# Altium project Social_Security_PRJ.PrjPcb
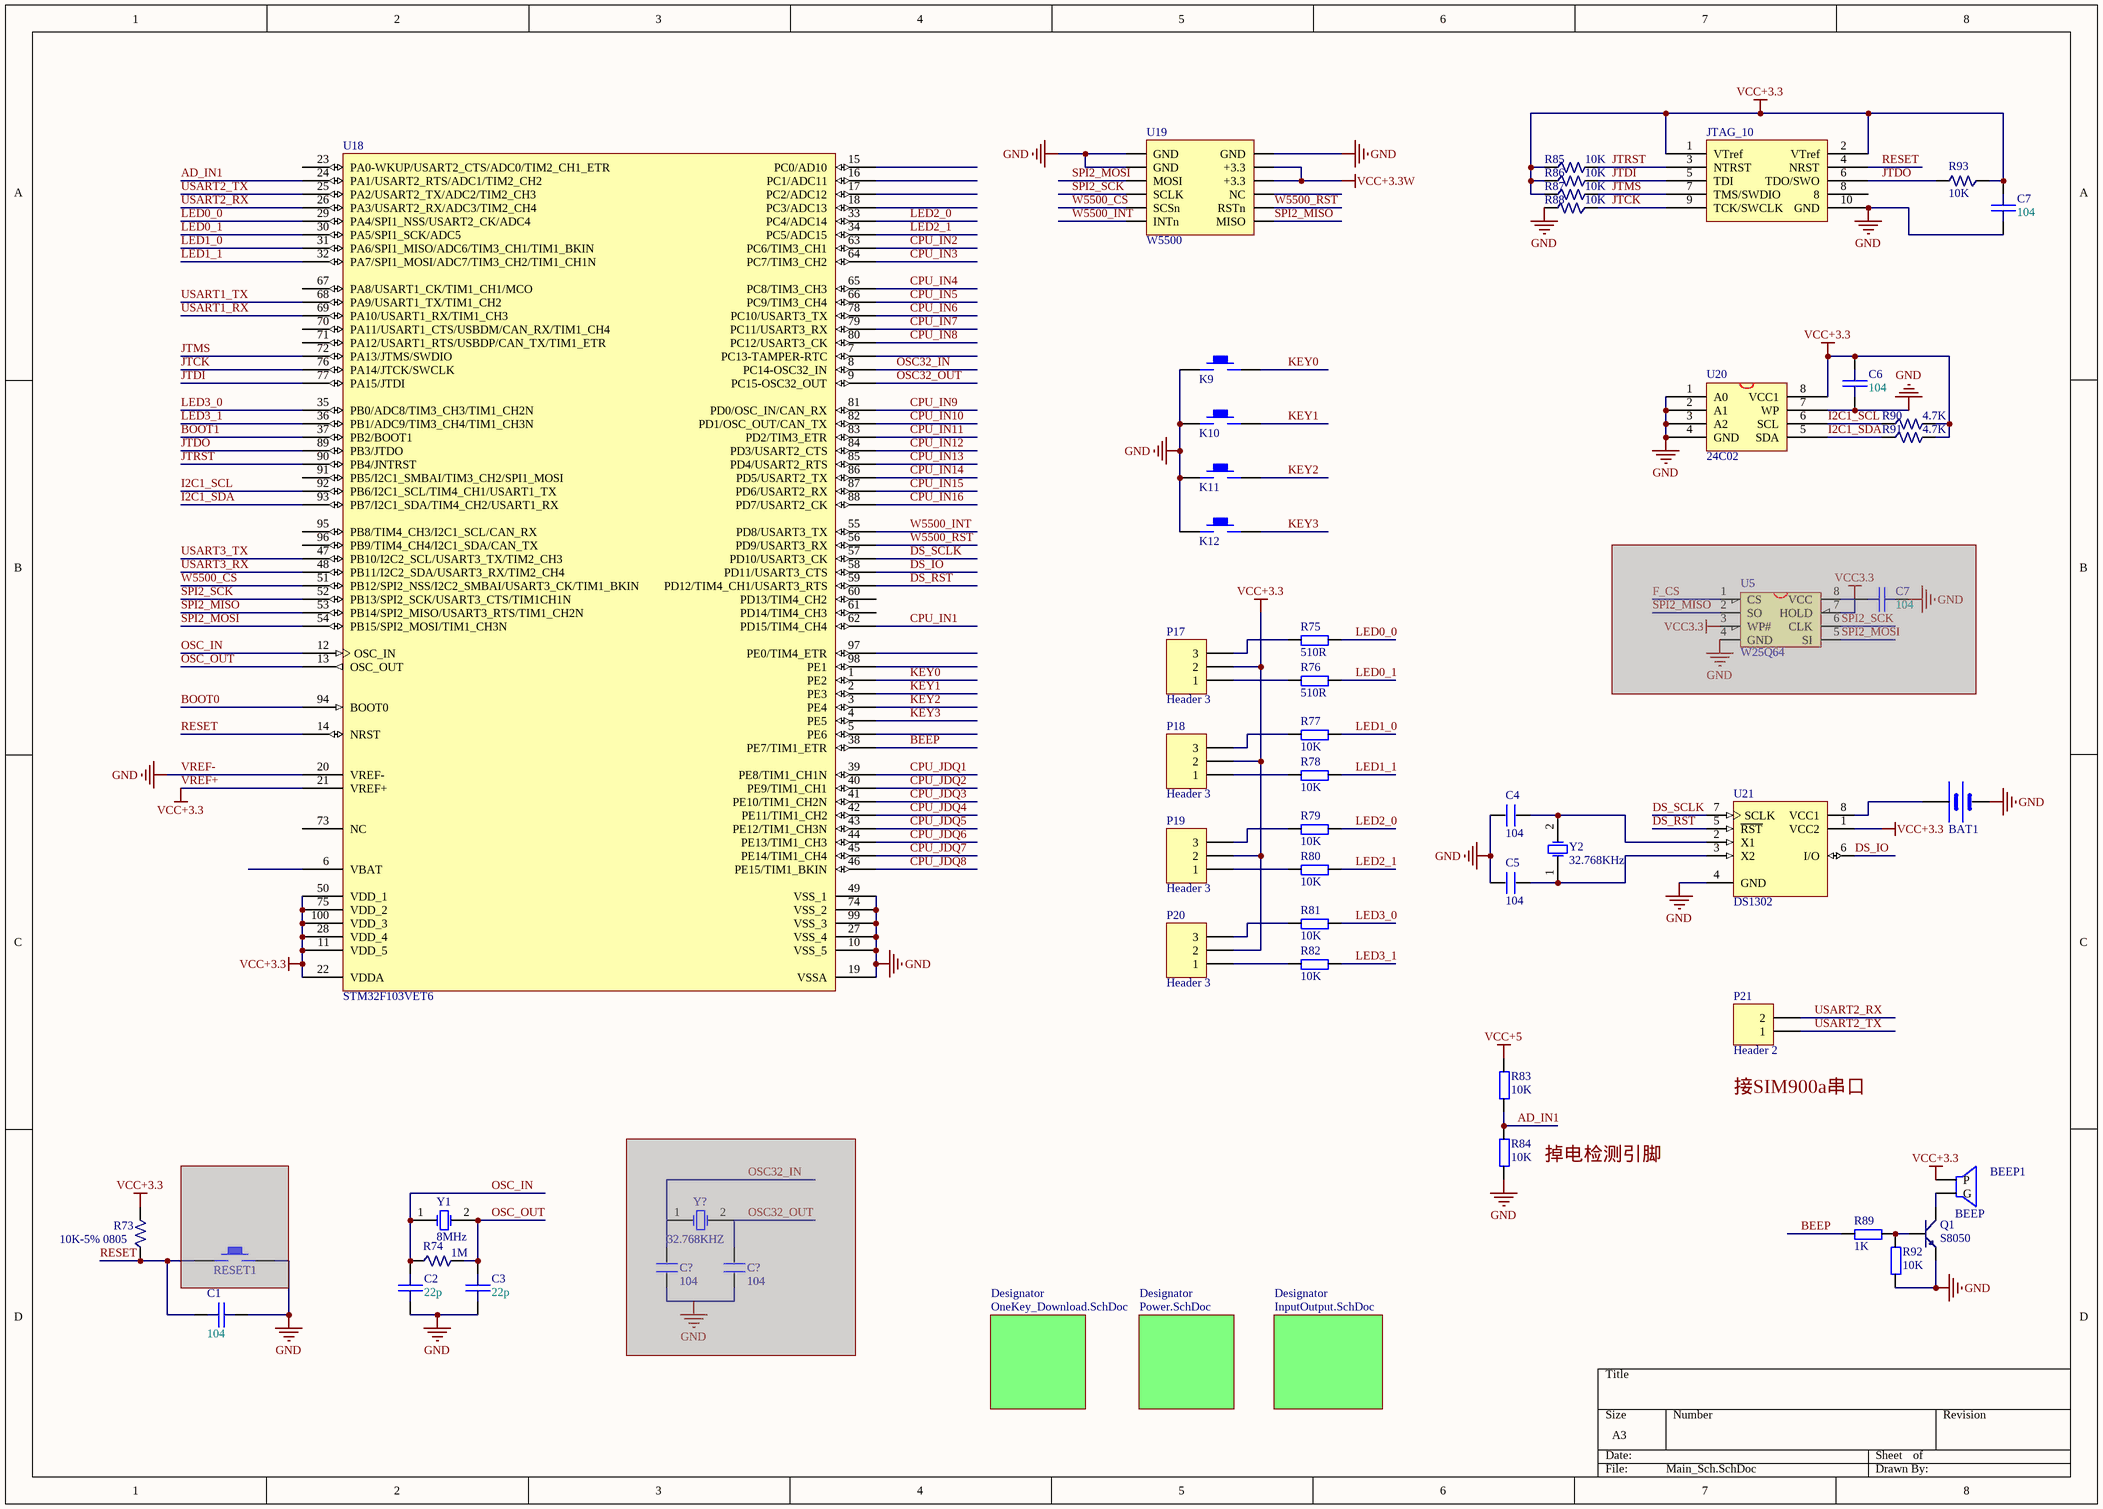
[diagram p0: Main_Sch.SchDoc]
4 sheets, 258 parts. Net scope: global (net labels, ports and power ports of the same name join across sheets).
Board file: Main_PCB.PcbDoc
Sheets:
  Main_Sch.SchDoc
    Designator = OneKey_Download.SchDoc
    Designator = Power.SchDoc
    Designator = InputOutput.SchDoc

## Sheet Main_Sch.SchDoc
size A3

### Parts
(Parts that share a designator on the sheet are numbered #1, #2 ... from top to bottom, then left to right.)
BAT1  BATT  [CR2032]  (value not drawn)
BEEP1  BEEP  [BELL-5]
C1  104  [0805-CAP]
C2  22p  [0805-CAP]
C3  22p  [0805-CAP]
C4  104  [0805-CAP]
C5  104  [0805-CAP]
C6  104  [0805-CAP]
C7#1  104  [0805-CAP]
C7#2  104  [0805-CAP]  (masked out: inside a compile mask, not in the netlist)
C?#1  104  [0805-CAP]  (masked out: inside a compile mask, not in the netlist)
C?#2  104  [0805-CAP]  (masked out: inside a compile mask, not in the netlist)
JTAG_1  JTAG_10  [JTAG_10]
K9  KEY_M  [KEY_M]  (value not drawn)
K10  KEY_M  [KEY_M]  (value not drawn)
K11  KEY_M  [KEY_M]  (value not drawn)
K12  KEY_M  [KEY_M]  (value not drawn)
P17  Header 3  [HDR1X3]
P18  Header 3  [HDR1X3]
P19  Header 3  [HDR1X3]
P20  Header 3  [HDR1X3]
P21  Header 2  [HDR1X2]
Q1  S8050  [SOT-23R]
R73  10K-5% 0805  [0805-RES]
R74  1M  [0805-RES]
R75  510R  [0805-RES]
R76  510R  [0805-RES]
R77  10K  [0805-RES]
R78  10K  [0805-RES]
R79  10K  [0805-RES]
R80  10K  [0805-RES]
R81  10K  [0805-RES]
R82  10K  [0805-RES]
R83  10K  [0805-RES]
R84  10K  [0805-RES]
R85  10K  [0805-RES]
R86  10K  [0805-RES]
R87  10K  [0805-RES]
R88  10K  [0805-RES]
R89  1K  [0805-RES]
R90  4.7K  [0805-RES]
R91  4.7K  [0805-RES]
R92  10K  [0805-RES]
R93  10K  [0805-RES]
RESET1  KEY_M  [KEY_M]  (value not drawn)  (masked out: inside a compile mask, not in the netlist)
U5#1  W25Q64  [SOIC-8]  (masked out: inside a compile mask, not in the netlist)
U18  STM32F103VET6  [LQFP100_N]
U19  W5500  [W5500-Model]
U20  24C02  [SOP-8]
U21  DS1302  [SOP-8]
Y1  8MHz  [XTAL_US]
Y2  32.768KHz  [XTAL32_1]
Y?  32.768KHZ  [XTAL32_1]  (masked out: inside a compile mask, not in the netlist)

### Sub-sheets
Designator = OneKey_Download.SchDoc: no entries
Designator = Power.SchDoc: no entries
Designator = InputOutput.SchDoc: no entries

### Nets
VCC+3.3W: U19.10(+3.3) U19.11(+3.3)
VCC+5: R83.2
VREF+: BEEP1.1(P) C6.1 C7#1.1 JTAG_1.1(VTref) JTAG_1.2(VTref) P17.2 P18.2 P19.2 P20.2 R73.2 R85.1 R86.1 R87.1 R90.2 R91.2 R93.1 U18.11(VDD_5) U18.21(VREF+) U18.22(VDDA) U18.28(VDD_4) U18.50(VDD_1) U18.75(VDD_2) U18.100(VDD_3) U20.8(VCC1) U21.1(VCC2)  [also labelled VCC+3.3]
VREF-: BAT1.2(GND) C1.2 C2.2 C3.2 C4.1 C5.1 C6.2 C7#1.2 JTAG_1.10(GND) K9.1 K10.1 K11.1 K12.1 Q1.1(E) R84.1 R88.2 R92.1 U18.10(VSS_5) U18.19(VSSA) U18.20(VREF-) U18.27(VSS_4) U18.49(VSS_1) U18.74(VSS_2) U18.99(VSS_3) U19.1(GND) U19.2(GND) U19.12(GND) U20.1(A0) U20.2(A1) U20.3(A2) U20.4(GND) U20.7(WP) U21.4(GND)  [also labelled GND]
AD_IN1: R83.1 R84.2 U18.24(PA1/USART2_RTS/ADC1/TIM2_CH2)
BEEP: R89.1 U18.38(PE7/TIM1_ETR)
BOOT0: U18.94(BOOT0)
BOOT1: U18.37(PB2/BOOT1)
CPU_IN1: U18.62(PD15/TIM4_CH4)
CPU_IN2: U18.63(PC6/TIM3_CH1)
CPU_IN3: U18.64(PC7/TIM3_CH2)
CPU_IN4: U18.65(PC8/TIM3_CH3)
CPU_IN5: U18.66(PC9/TIM3_CH4)
CPU_IN6: U18.78(PC10/USART3_TX)
CPU_IN7: U18.79(PC11/USART3_RX)
CPU_IN8: U18.80(PC12/USART3_CK)
CPU_IN9: U18.81(PD0/OSC_IN/CAN_RX)
CPU_IN10: U18.82(PD1/OSC_OUT/CAN_TX)
CPU_IN11: U18.83(PD2/TIM3_ETR)
CPU_IN12: U18.84(PD3/USART2_CTS)
CPU_IN13: U18.85(PD4/USART2_RTS)
CPU_IN14: U18.86(PD5/USART2_TX)
CPU_IN15: U18.87(PD6/USART2_RX)
CPU_IN16: U18.88(PD7/USART2_CK)
CPU_JDQ1: U18.39(PE8/TIM1_CH1N)
CPU_JDQ2: U18.40(PE9/TIM1_CH1)
CPU_JDQ3: U18.41(PE10/TIM1_CH2N)
CPU_JDQ4: U18.42(PE11/TIM1_CH2)
CPU_JDQ5: U18.43(PE12/TIM1_CH3N)
CPU_JDQ6: U18.44(PE13/TIM1_CH3)
CPU_JDQ7: U18.45(PE14/TIM1_CH4)
CPU_JDQ8: U18.46(PE15/TIM1_BKIN)
DS_IO: U18.58(PD11/USART3_CTS) U21.6(I/O)
DS_RST: U18.59(PD12/TIM4_CH1/USART3_RTS) U21.5(~{RST})
DS_SCLK: U18.57(PD10/USART3_CK) U21.7(SCLK)
I2C1_SCL: R90.1 U18.92(PB6/I2C1_SCL/TIM4_CH1/USART1_TX) U20.6(SCL)
I2C1_SDA: R91.1 U18.93(PB7/I2C1_SDA/TIM4_CH2/USART1_RX) U20.5(SDA)
JTCK: JTAG_1.9(TCK/SWCLK) R88.1 U18.76(PA14/JTCK/SWCLK)
JTDI: JTAG_1.5(TDI) R86.2 U18.77(PA15/JTDI)
JTDO: JTAG_1.6(TDO/SWO) R93.2 U18.89(PB3/JTDO)
JTMS: JTAG_1.7(TMS/SWDIO) R87.2 U18.72(PA13/JTMS/SWDIO)
JTRST: JTAG_1.3(NTRST) R85.2 U18.90(PB4/JNTRST)
KEY0: K9.2 U18.1(PE2)
KEY1: K10.2 U18.2(PE3)
KEY2: K11.2 U18.3(PE4)
KEY3: K12.2 U18.4(PE5)
LED0_0: R75.2 U18.29(PA4/SPI1_NSS/USART2_CK/ADC4)
LED0_1: R76.2 U18.30(PA5/SPI1_SCK/ADC5)
LED1_0: R77.2 U18.31(PA6/SPI1_MISO/ADC6/TIM3_CH1/TIM1_BKIN)
LED1_1: R78.2 U18.32(PA7/SPI1_MOSI/ADC7/TIM3_CH2/TIM1_CH1N)
LED2_0: R79.2 U18.33(PC4/ADC14)
LED2_1: R80.2 U18.34(PC5/ADC15)
LED3_0: R81.2 U18.35(PB0/ADC8/TIM3_CH3/TIM1_CH2N)
LED3_1: R82.2 U18.36(PB1/ADC9/TIM3_CH4/TIM1_CH3N)
OSC32_IN: U18.8(PC14-OSC32_IN)
OSC32_OUT: U18.9(PC15-OSC32_OUT)
OSC_IN: C2.1 R74.1 U18.12(OSC_IN) Y1.1(OSC1)
OSC_OUT: C3.1 R74.2 U18.13(OSC_OUT) Y1.2(OSC2)
RESET: C1.1 JTAG_1.4(NRST) R73.1 U18.14(NRST)
SPI2_MISO: U18.53(PB14/SPI2_MISO/USART3_RTS/TIM1_CH2N) U19.7(MISO)
SPI2_MOSI: U18.54(PB15/SPI2_MOSI/TIM1_CH3N) U19.3(MOSI)
SPI2_SCK: U18.52(PB13/SPI2_SCK/USART3_CTS/TIM1CH1N) U19.4(SCLK)
USART1_RX: U18.69(PA10/USART1_RX/TIM1_CH3)
USART1_TX: U18.68(PA9/USART1_TX/TIM1_CH2)
USART2_RX: P21.2 U18.26(PA3/USART2_RX/ADC3/TIM2_CH4)
USART2_TX: P21.1 U18.25(PA2/USART2_TX/ADC2/TIM2_CH3)
USART3_RX: U18.48(PB11/I2C2_SDA/USART3_RX/TIM2_CH4)
USART3_TX: U18.47(PB10/I2C2_SCL/USART3_TX/TIM2_CH3)
W5500_CS: U18.51(PB12/SPI2_NSS/I2C2_SMBAI/USART3_CK/TIM1_BKIN) U19.5(SCSn)
W5500_INT: U18.55(PD8/USART3_TX) U19.6(INTn)
W5500_RST: U18.56(PD9/USART3_RX) U19.8(RSTn)
NetBAT1_1: BAT1.1(VCC) U21.8(VCC1)
NetBEEP1_2: BEEP1.2(G) Q1.3(C)
NetC4_2: C4.2 U21.2(X1) Y2.2(OSC2)
NetC5_2: C5.2 U21.3(X2) Y2.1(OSC1)
NetP17_1: P17.1 R76.1
NetP17_3: P17.3 R75.1
NetP18_1: P18.1 R78.1
NetP18_3: P18.3 R77.1
NetP19_1: P19.1 R80.1
NetP19_3: P19.3 R79.1
NetP20_1: P20.1 R82.1
NetP20_3: P20.3 R81.1
NetQ1_2: Q1.2(B) R89.2 R92.2

Not connected (* = marked no-connect by the designer): JTAG_1 8; U18 5(PE6) 6(VBAT) 7(PC13-TAMPER-RTC) 15(PC0/AD10) 16(PC1/ADC11) 17(PC2/ADC12) 18(PC3/ADC13) 23(PA0-WKUP/USART2_CTS/ADC0/TIM2_CH1_ETR) 60(PD13/TIM4_CH2) 61(PD14/TIM4_CH3) 67(PA8/USART1_CK/TIM1_CH1/MCO) 70(PA11/USART1_CTS/USBDM/CAN_RX/TIM1_CH4) 71(PA12/USART1_RTS/USBDP/CAN_TX/TIM1_ETR) 73(NC) 91(PB5/I2C1_SMBAI/TIM3_CH2/SPI1_MOSI) 95(PB8/TIM4_CH3/I2C1_SCL/CAN_RX) 96(PB9/TIM4_CH4/I2C1_SDA/CAN_TX) 97(PE0/TIM4_ETR) 98(PE1); U19 9(NC)

### Notes on the sheet
- (near P21) 接SIM900a串口
- 掉电检测引脚

### Library data of the parts
BAT1 = BAT
C1-C3 C6 C7#1 C7#2 = CAP: 陶瓷电容
C4 C5 C?#1 C?#2 = C
P17-P20 = Header 3: Header, 3-Pin; LatestRevisionDate: 17-Jul-2002; LatestRevisionNote: Re-released for DXP Platform.; Publisher: Altium Limited
P21 = Header 2: Header, 2-Pin; LatestRevisionDate: 17-Jul-2002; LatestRevisionNote: Re-released for DXP Platform.; Publisher: Altium Limited
Q1 = NPN: 8050/BCW846/BCW847
R73 R74 R85-R88 R90 R91 R93 = RES-1%: 高精度电阻
R75-R84 = Res
R89 R92 = R
U5#1 = W25X16: W25X16;SST25VF016;MX25L1605
U18 = STM32F103VET6: STM32 ARM-based 32-bit MCU with 64 Kbytes Flash, 100-pin LQFP, Industrial Temperature; Published: 30-May-2008; DatasheetVersion: rev6, Mar-2008; PackageVersion: Mar-2008; PackageReference: LQFP100; Publisher: Altium Limited; PackageDescription: 100-Pin Low-Profile Quad Flat Pack, 14 x 14 mm Body, 0.5 mm Pitch (LQFP100); ComponentLink1Description: Manufacturer Link; ComponentLink1URL: www.st.com/stm32; ComponentLink2Description: Datasheet; ComponentLink2URL: http://www.st.com/stonline/products/literature/ds/13587.pdf
U20 = 24C256
U21 = DS1302: 实时时钟
Y1 Y2 Y? = XTAL: Crystal Oscillator; Published: 8-Jun-2000; LatestRevisionDate: 17-Jul-2002; LatestRevisionNote: Re-released for DXP Platform.; Publisher: Altium Limited

## Sheet OneKey_Download.SchDoc
size A4
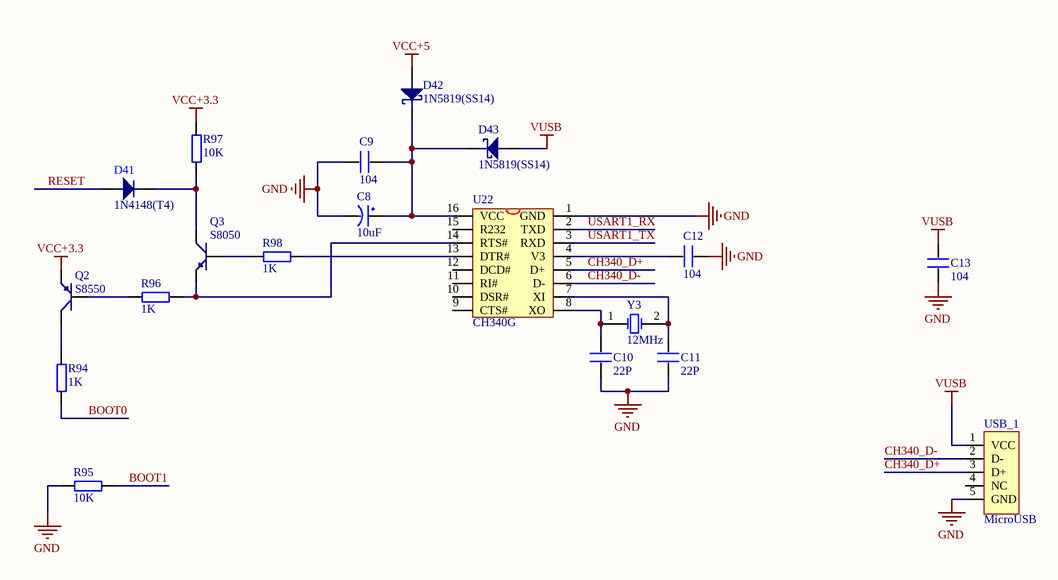
[diagram p1: OneKey_Download.SchDoc]

### Parts
C8  10uF  [CAP2.54]
C9  104  [0805-CAP]
C10  22P  [0805-CAP]
C11  22P  [0805-CAP]
C12  104  [0805-CAP]
C13  104  [0805-CAP]
D41  1N4148(T4)  [SOD-123]
D42  1N5819(SS14)  [DO-214AC(SMA)]
D43  1N5819(SS14)  [DO-214AC(SMA)]
Q2  S8550  [SOT-23R]
Q3  S8050  [SOT-23R]
R94  1K  [0805-RES]
R95  10K  [0805-RES]
R96  1K  [0805-RES]
R97  10K  [0805-RES]
R98  1K  [0805-RES]
U22  CH340G  [SOP16M]
USB_1  MicroUSB  [USB_micro]
Y3  12MHz  [XTAL_US]

### Nets
GND: C8.2(GND) C9.1 C10.1 C11.1 C12.2 C13.1 R95.1 U22.1(GND) USB_1.5(GND)  [project net VREF-]
VCC+3.3: Q2.1(E) R97.2  [project net VREF+]
VCC+5: D42.1
VUSB: C13.2 D43.1 USB_1.1(VCC)
BOOT0: R94.1
BOOT1: R95.2
CH340_D+: U22.5(D+) USB_1.3(D+)
CH340_D-: U22.6(D-) USB_1.2(D-)
RESET: D41.1
USART1_RX: U22.2(TXD)
USART1_TX: U22.3(RXD)
NetC8_1: C8.1(VCC) C9.2 D42.2 D43.2 U22.16(VCC)
NetC10_2: C10.2 U22.8(XO) Y3.1(OSC1)
NetC11_2: C11.2 U22.7(XI) Y3.2(OSC2)
NetC12_1: C12.1 U22.4(V3)
NetD41_2: D41.2 Q3.3(C) R97.1
NetQ2_2: Q2.2(B) R96.1
NetQ2_3: Q2.3(C) R94.2
NetQ3_1: Q3.1(E) R96.2 U22.14(RTS#)
NetQ3_2: Q3.2(B) R98.1
NetR98_2: R98.2 U22.13(DTR#)

Not connected (* = marked no-connect by the designer): U22 9(CTS#) 10(DSR#) 11(RI#) 12(DCD#) 15(R232); USB_1 4(NC)

### Library data of the parts
C8 = CAP
C9-C13 = C
D41 = 1N4148: 高速开关二极管
D42 D43 = 1N5819(SS14): 肖特基二极管
Q2 = PNP: 8550/BCW68
Q3 = NPN: 8050/BCW846/BCW847
R94-R98 = Res
U22 = CH340G: USB2UART
USB_1 = USB5
Y3 = XTAL: Crystal Oscillator; Published: 8-Jun-2000; LatestRevisionDate: 17-Jul-2002; LatestRevisionNote: Re-released for DXP Platform.; Publisher: Altium Limited

## Sheet Power.SchDoc
size A4
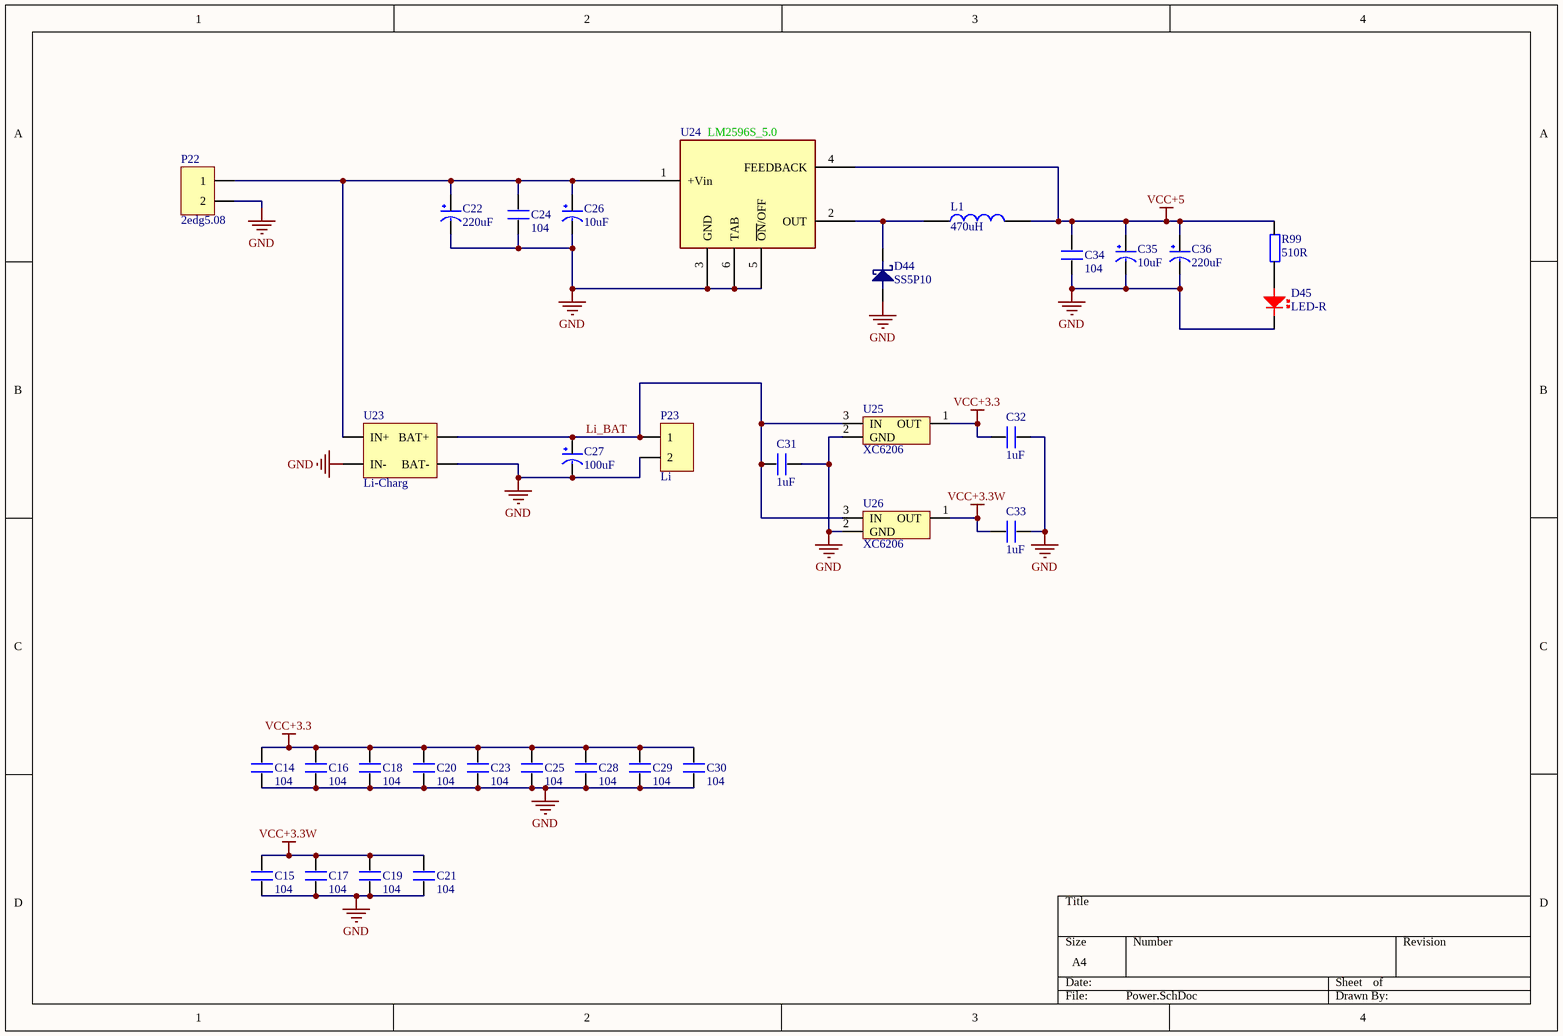
[diagram p2: Power.SchDoc]

### Parts
C14  104  [0805-CAP]
C15  104  [0805-CAP]
C16  104  [0805-CAP]
C17  104  [0805-CAP]
C18  104  [0805-CAP]
C19  104  [0805-CAP]
C20  104  [0805-CAP]
C21  104  [0805-CAP]
C22  220uF  [CAP3.0]
C23  104  [0805-CAP]
C24  104  [0805-CAP]
C25  104  [0805-CAP]
C26  10uF  [CAP3.0]
C27  100uF  [CAP2.54]
C28  104  [0805-CAP]
C29  104  [0805-CAP]
C30  104  [0805-CAP]
C31  1uF  [0805-CAP]
C32  1uF  [0805-CAP]
C33  1uF  [0805-CAP]
C34  104  [0805-CAP]
C35  10uF  [CAP3.0]
C36  220uF  [CAP3.0]
D44  SS5P10  [TO-277A]
D45  LED-R  [DIO-LIG]
L1  470uH  [MSS1278CUST]
P22  2edg5.08  [2edg5.08_2]
P23  Li  [2edg5.08_2]
R99  510R  [0805-RES]
U23  Li-Charg  [Li-Charg]
U24  LM2596S_5.0  [TO-263-5-2]
U25  XC6206  [SOT-23R]
U26  XC6206  [SOT-23R]

### Nets
GND: C14.1 C15.1 C16.1 C17.1 C18.1 C19.1 C20.1 C21.1 C22.2(GND) C23.1 C24.1 C25.1 C26.2(GND) C27.2(GND) C28.1 C29.1 C30.1 C31.2 C32.2 C33.2 C34.1 C35.2(GND) C36.2(GND) D44.1 D45.2 P22.2 P23.2 U23.2(IN-) U23.3(BAT-) U24.3(GND) U24.5(~{ON}/OFF) U24.6(TAB) U25.2(GND) U26.2(GND)  [project net VREF-]
VCC+3.3: C14.2 C16.2 C18.2 C20.2 C23.2 C25.2 C28.2 C29.2 C30.2 C32.1 U25.1(OUT)  [project net VREF+]
VCC+3.3W: C15.2 C17.2 C19.2 C21.2 C33.1 U26.1(OUT)
VCC+5: C34.2 C35.1(VCC) C36.1(VCC) L1.2 R99.2 U24.4(FEEDBACK)
Li_BAT: C27.1(VCC) C31.1 P23.1 U23.4(BAT+) U25.3(IN) U26.3(IN)
NetC22_1: C22.1(VCC) C24.2 C26.1(VCC) P22.1 U23.1(IN+) U24.1(+Vin)
NetD44_2: D44.2 L1.1 U24.2(OUT)
NetD45_1: D45.1 R99.1

### Library data of the parts
C14-C21 C23-C25 C28-C34 = C
C22 C26 C27 C35 C36 = CAP
D44 = SS5P10: 肖特基二极管
D45 = LED-RED: 红色LED
L1 = INDUCTOR
P22 P23 = 2EDG5.08_2: 端子
R99 = Res
U23 = Li-Charg: 锂电池充电模块
U24 = LM2596S_5.0: 3A开关电源芯片
U25 U26 = XC6206: LDO

## Sheet InputOutput.SchDoc
size A2
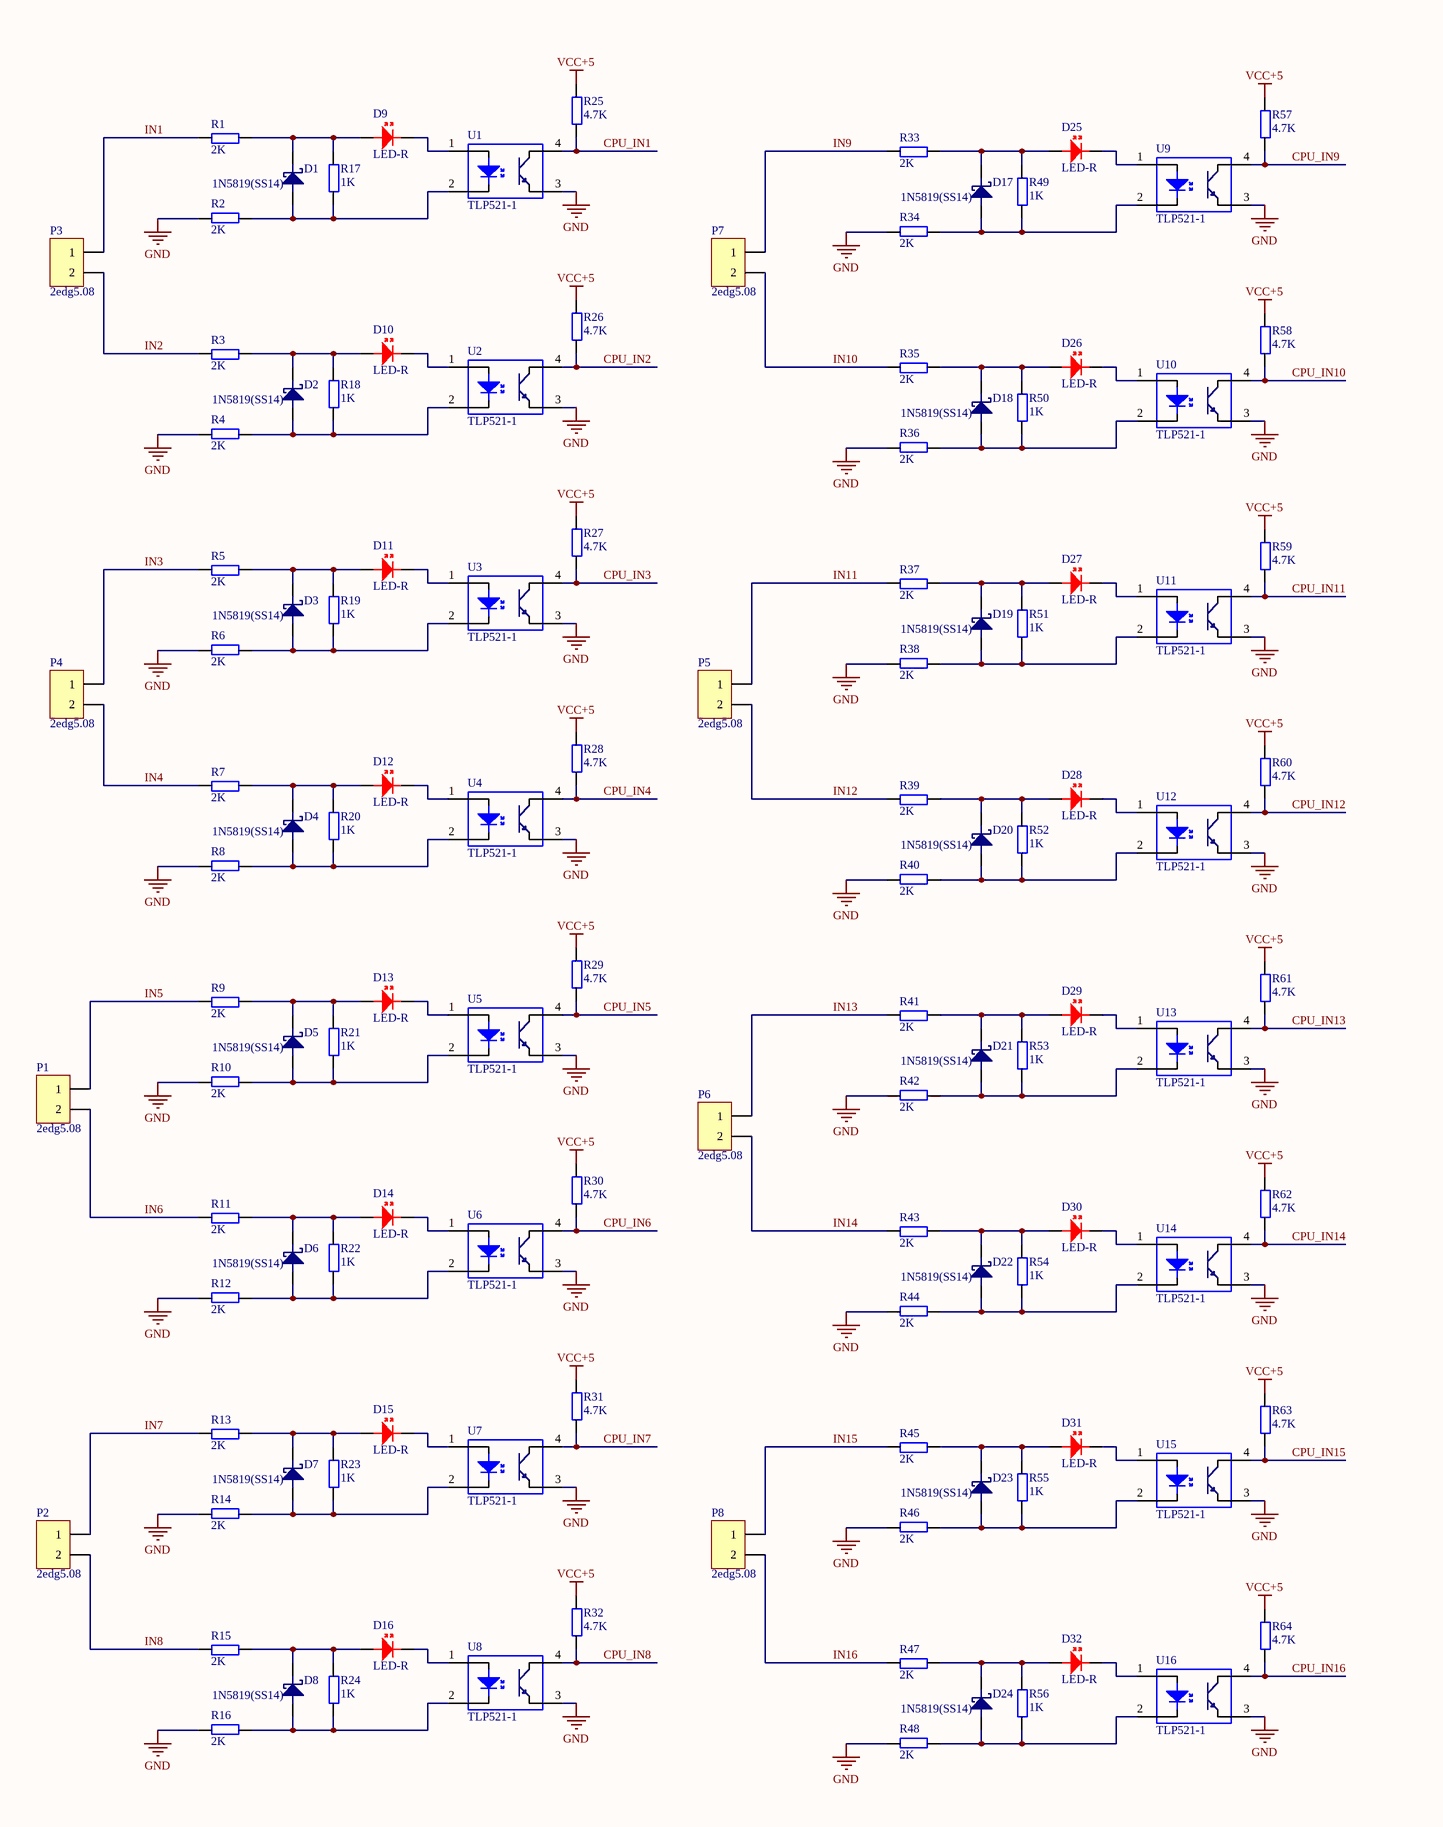
[diagram p3: InputOutput.SchDoc, left]
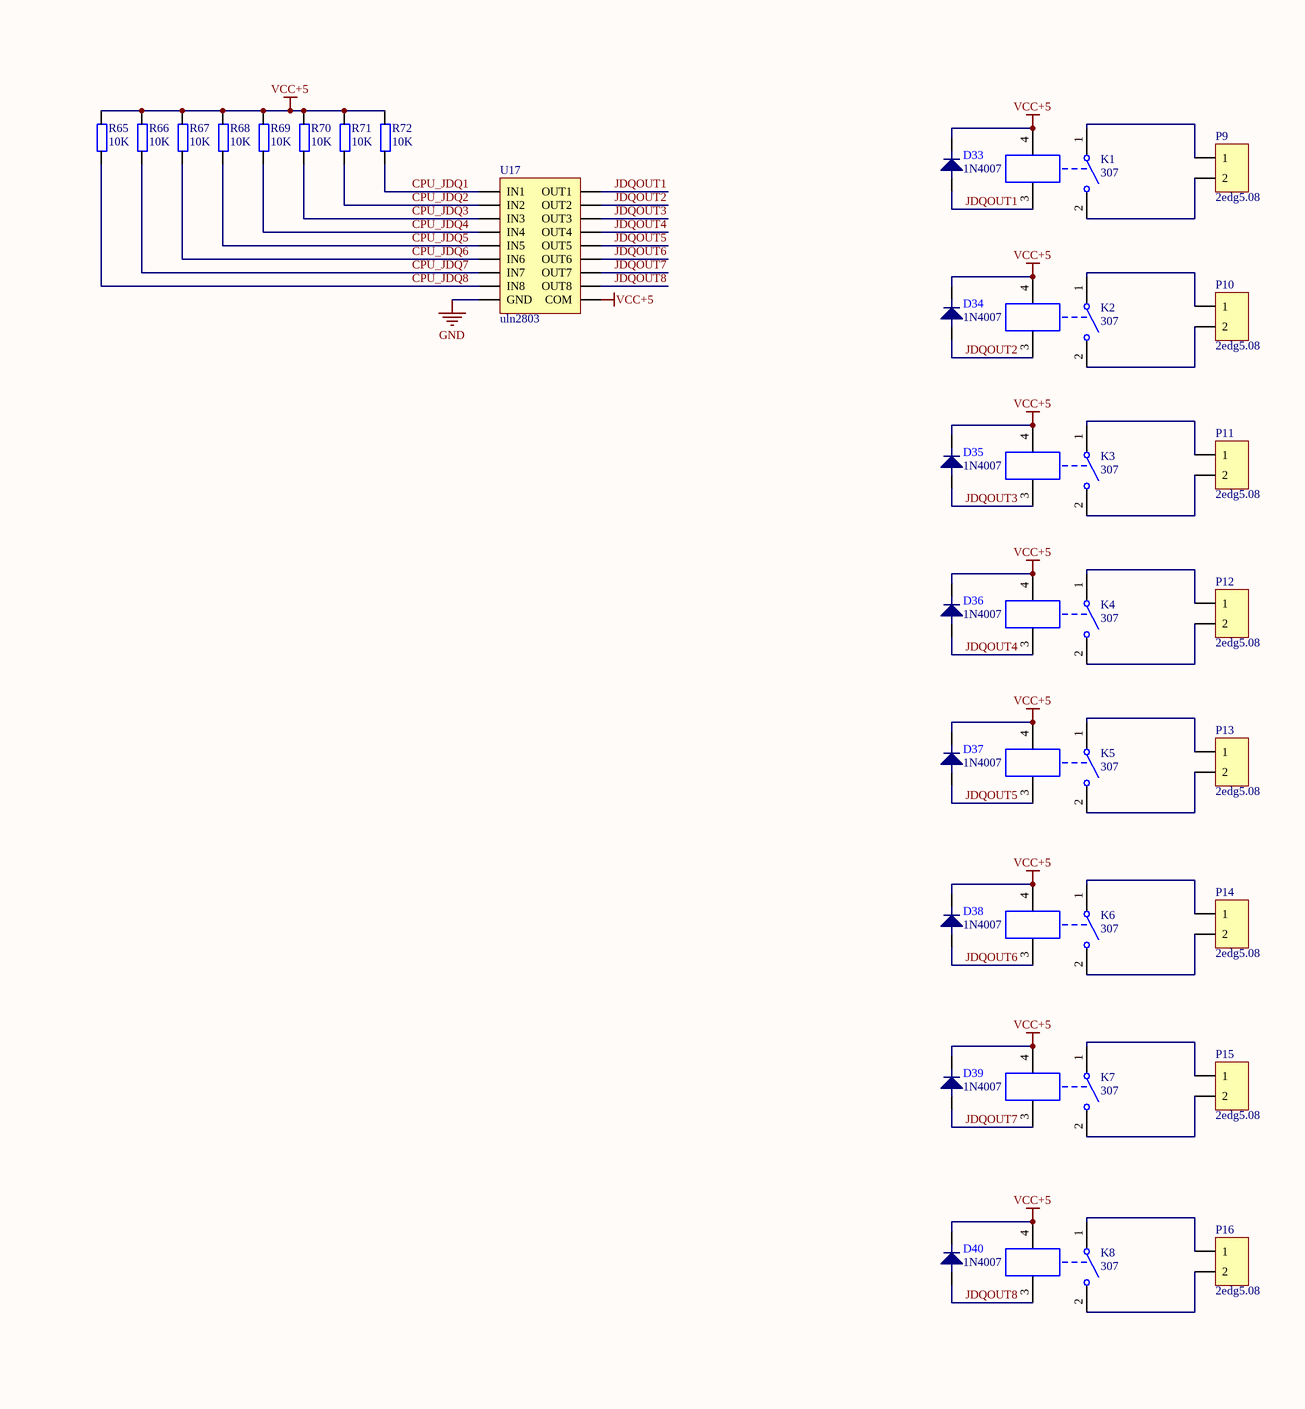
[diagram p4: InputOutput.SchDoc, right]

### Parts
(Parts that share a designator on the sheet are numbered #1, #2 ... from top to bottom, then left to right.)
D1  1N5819(SS14)  [DO-214AC(SMA)]
D2  1N5819(SS14)  [DO-214AC(SMA)]
D3  1N5819(SS14)  [DO-214AC(SMA)]
D4  1N5819(SS14)  [DO-214AC(SMA)]
D5  1N5819(SS14)  [DO-214AC(SMA)]
D6  1N5819(SS14)  [DO-214AC(SMA)]
D7  1N5819(SS14)  [DO-214AC(SMA)]
D8  1N5819(SS14)  [DO-214AC(SMA)]
D9  LED-R  [0805-LED]
D10  LED-R  [0805-LED]
D11  LED-R  [0805-LED]
D12  LED-R  [0805-LED]
D13  LED-R  [0805-LED]
D14  LED-R  [0805-LED]
D15  LED-R  [0805-LED]
D16  LED-R  [0805-LED]
D17  1N5819(SS14)  [DO-214AC(SMA)]
D18  1N5819(SS14)  [DO-214AC(SMA)]
D19  1N5819(SS14)  [DO-214AC(SMA)]
D20  1N5819(SS14)  [DO-214AC(SMA)]
D21  1N5819(SS14)  [DO-214AC(SMA)]
D22  1N5819(SS14)  [DO-214AC(SMA)]
D23  1N5819(SS14)  [DO-214AC(SMA)]
D24  1N5819(SS14)  [DO-214AC(SMA)]
D25  LED-R  [0805-LED]
D26  LED-R  [0805-LED]
D27  LED-R  [0805-LED]
D28  LED-R  [0805-LED]
D29  LED-R  [0805-LED]
D30  LED-R  [0805-LED]
D31  LED-R  [0805-LED]
D32  LED-R  [0805-LED]
D33  1N4007  [DO-214AC(SMA)]
D34  1N4007  [DO-214AC(SMA)]
D35  1N4007  [DO-214AC(SMA)]
D36  1N4007  [DO-214AC(SMA)]
D37  1N4007  [DO-214AC(SMA)]
D38  1N4007  [DO-214AC(SMA)]
D39  1N4007  [DO-214AC(SMA)]
D40  1N4007  [DO-214AC(SMA)]
K1  307  [RELAY-SONGCHUAN]
K2  307  [RELAY-SONGCHUAN]
K3  307  [RELAY-SONGCHUAN]
K4  307  [RELAY-SONGCHUAN]
K5  307  [RELAY-SONGCHUAN]
K6  307  [RELAY-SONGCHUAN]
K7  307  [RELAY-SONGCHUAN]
K8  307  [RELAY-SONGCHUAN]
P1  2edg5.08  [2edg5.08_2]
P2  2edg5.08  [2edg5.08_2]
P3  2edg5.08  [2edg5.08_2]
P4  2edg5.08  [2edg5.08_2]
P5  2edg5.08  [2edg5.08_2]
P6  2edg5.08  [2edg5.08_2]
P7  2edg5.08  [2edg5.08_2]
P8  2edg5.08  [2edg5.08_2]
P9  2edg5.08  [2edg5.08_2]
P10  2edg5.08  [2edg5.08_2]
P11  2edg5.08  [2edg5.08_2]
P12  2edg5.08  [2edg5.08_2]
P13  2edg5.08  [2edg5.08_2]
P14  2edg5.08  [2edg5.08_2]
P15  2edg5.08  [2edg5.08_2]
P16  2edg5.08  [2edg5.08_2]
R1  2K  [0805-RES]
R2  2K  [0805-RES]
R3  2K  [0805-RES]
R4  2K  [0805-RES]
R5  2K  [0805-RES]
R6  2K  [0805-RES]
R7  2K  [0805-RES]
R8  2K  [0805-RES]
R9  2K  [0805-RES]
R10  2K  [0805-RES]
R11  2K  [0805-RES]
R12  2K  [0805-RES]
R13  2K  [0805-RES]
R14  2K  [0805-RES]
R15  2K  [0805-RES]
R16  2K  [0805-RES]
R17  1K  [0805-RES]
R18  1K  [0805-RES]
R19  1K  [0805-RES]
R20  1K  [0805-RES]
R21  1K  [0805-RES]
R22  1K  [0805-RES]
R23  1K  [0805-RES]
R24  1K  [0805-RES]
R25  4.7K  [0805-RES]
R26  4.7K  [0805-RES]
R27  4.7K  [0805-RES]
R28  4.7K  [0805-RES]
R29  4.7K  [0805-RES]
R30  4.7K  [0805-RES]
R31  4.7K  [0805-RES]
R32  4.7K  [0805-RES]
R33  2K  [0805-RES]
R34  2K  [0805-RES]
R35  2K  [0805-RES]
R36  2K  [0805-RES]
R37  2K  [0805-RES]
R38  2K  [0805-RES]
R39  2K  [0805-RES]
R40  2K  [0805-RES]
R41  2K  [0805-RES]
R42  2K  [0805-RES]
R43  2K  [0805-RES]
R44  2K  [0805-RES]
R45  2K  [0805-RES]
R46  2K  [0805-RES]
R47  2K  [0805-RES]
R48  2K  [0805-RES]
R49  1K  [0805-RES]
R50  1K  [0805-RES]
R51  1K  [0805-RES]
R52  1K  [0805-RES]
R53  1K  [0805-RES]
R54  1K  [0805-RES]
R55  1K  [0805-RES]
R56  1K  [0805-RES]
R57  4.7K  [0805-RES]
R58  4.7K  [0805-RES]
R59  4.7K  [0805-RES]
R60  4.7K  [0805-RES]
R61  4.7K  [0805-RES]
R62  4.7K  [0805-RES]
R63  4.7K  [0805-RES]
R64  4.7K  [0805-RES]
R65  10K  [0805-RES]
R66  10K  [0805-RES]
R67  10K  [0805-RES]
R68  10K  [0805-RES]
R69  10K  [0805-RES]
R70  10K  [0805-RES]
R71  10K  [0805-RES]
R72  10K  [0805-RES]
U1  TLP521-1  [DIP4]
U2  TLP521-1  [DIP4]
U3  TLP521-1  [DIP4]
U4  TLP521-1  [DIP4]
U5#2  TLP521-1  [DIP4]
U6  TLP521-1  [DIP4]
U7  TLP521-1  [DIP4]
U8  TLP521-1  [DIP4]
U9  TLP521-1  [DIP4]
U10  TLP521-1  [DIP4]
U11  TLP521-1  [DIP4]
U12  TLP521-1  [DIP4]
U13  TLP521-1  [DIP4]
U14  TLP521-1  [DIP4]
U15  TLP521-1  [DIP4]
U16  TLP521-1  [DIP4]
U17  uln2803  [SOP18]

### Nets
GND: R2.2 R4.2 R6.2 R8.2 R10.2 R12.2 R14.2 R16.2 R34.2 R36.2 R38.2 R40.2 R42.2 R44.2 R46.2 R48.2 U1.3 U2.3 U3.3 U4.3 U5#2.3 U6.3 U7.3 U8.3 U9.3 U10.3 U11.3 U12.3 U13.3 U14.3 U15.3 U16.3 U17.9(GND)  [project net VREF-]
VCC+5: D33.2 D34.2 D35.2 D36.2 D37.2 D38.2 D39.2 D40.2 K1.4 K2.4 K3.4 K4.4 K5.4 K6.4 K7.4 K8.4 R25.2 R26.2 R27.2 R28.2 R29.2 R30.2 R31.2 R32.2 R57.2 R58.2 R59.2 R60.2 R61.2 R62.2 R63.2 R64.2 R65.2 R66.2 R67.2 R68.2 R69.2 R70.2 R71.2 R72.2 U17.10(COM)
CPU_IN1: R25.1 U1.4
CPU_IN2: R26.1 U2.4
CPU_IN3: R27.1 U3.4
CPU_IN4: R28.1 U4.4
CPU_IN5: R29.1 U5#2.4
CPU_IN6: R30.1 U6.4
CPU_IN7: R31.1 U7.4
CPU_IN8: R32.1 U8.4
CPU_IN9: R57.1 U9.4
CPU_IN10: R58.1 U10.4
CPU_IN11: R59.1 U11.4
CPU_IN12: R60.1 U12.4
CPU_IN13: R61.1 U13.4
CPU_IN14: R62.1 U14.4
CPU_IN15: R63.1 U15.4
CPU_IN16: R64.1 U16.4
CPU_JDQ1: R72.1 U17.1(IN1)
CPU_JDQ2: R71.1 U17.2(IN2)
CPU_JDQ3: R70.1 U17.3(IN3)
CPU_JDQ4: R69.1 U17.4(IN4)
CPU_JDQ5: R68.1 U17.5(IN5)
CPU_JDQ6: R67.1 U17.6(IN6)
CPU_JDQ7: R66.1 U17.7(IN7)
CPU_JDQ8: R65.1 U17.17(IN8)
IN1: P3.1 R1.1
IN2: P3.2 R3.1
IN3: P4.1 R5.1
IN4: P4.2 R7.1
IN5: P1.1 R9.1
IN6: P1.2 R11.1
IN7: P2.1 R13.1
IN8: P2.2 R15.1
IN9: P7.1 R33.1
IN10: P7.2 R35.1
IN11: P5.1 R37.1
IN12: P5.2 R39.1
IN13: P6.1 R41.1
IN14: P6.2 R43.1
IN15: P8.1 R45.1
IN16: P8.2 R47.1
JDQOUT1: D33.1 K1.3 U17.18(OUT1)
JDQOUT2: D34.1 K2.3 U17.17(OUT2)
JDQOUT3: D35.1 K3.3 U17.16(OUT3)
JDQOUT4: D36.1 K4.3 U17.15(OUT4)
JDQOUT5: D37.1 K5.3 U17.14(OUT5)
JDQOUT6: D38.1 K6.3 U17.13(OUT6)
JDQOUT7: D39.1 K7.3 U17.12(OUT7)
JDQOUT8: D40.1 K8.3 U17.11(OUT8)
NetD1_1: D1.1 R2.1 R17.1 U1.2
NetD1_2: D1.2 D9.1 R1.2 R17.2
NetD2_1: D2.1 R4.1 R18.1 U2.2
NetD2_2: D2.2 D10.1 R3.2 R18.2
NetD3_1: D3.1 R6.1 R19.1 U3.2
NetD3_2: D3.2 D11.1 R5.2 R19.2
NetD4_1: D4.1 R8.1 R20.1 U4.2
NetD4_2: D4.2 D12.1 R7.2 R20.2
NetD5_1: D5.1 R10.1 R21.1 U5#2.2
NetD5_2: D5.2 D13.1 R9.2 R21.2
NetD6_1: D6.1 R12.1 R22.1 U6.2
NetD6_2: D6.2 D14.1 R11.2 R22.2
NetD7_1: D7.1 R14.1 R23.1 U7.2
NetD7_2: D7.2 D15.1 R13.2 R23.2
NetD8_1: D8.1 R16.1 R24.1 U8.2
NetD8_2: D8.2 D16.1 R15.2 R24.2
NetD9_2: D9.2 U1.1
NetD10_2: D10.2 U2.1
NetD11_2: D11.2 U3.1
NetD12_2: D12.2 U4.1
NetD13_2: D13.2 U5#2.1
NetD14_2: D14.2 U6.1
NetD15_2: D15.2 U7.1
NetD16_2: D16.2 U8.1
NetD17_1: D17.1 R34.1 R49.1 U9.2
NetD17_2: D17.2 D25.1 R33.2 R49.2
NetD18_1: D18.1 R36.1 R50.1 U10.2
NetD18_2: D18.2 D26.1 R35.2 R50.2
NetD19_1: D19.1 R38.1 R51.1 U11.2
NetD19_2: D19.2 D27.1 R37.2 R51.2
NetD20_1: D20.1 R40.1 R52.1 U12.2
NetD20_2: D20.2 D28.1 R39.2 R52.2
NetD21_1: D21.1 R42.1 R53.1 U13.2
NetD21_2: D21.2 D29.1 R41.2 R53.2
NetD22_1: D22.1 R44.1 R54.1 U14.2
NetD22_2: D22.2 D30.1 R43.2 R54.2
NetD23_1: D23.1 R46.1 R55.1 U15.2
NetD23_2: D23.2 D31.1 R45.2 R55.2
NetD24_1: D24.1 R48.1 R56.1 U16.2
NetD24_2: D24.2 D32.1 R47.2 R56.2
NetD25_2: D25.2 U9.1
NetD26_2: D26.2 U10.1
NetD27_2: D27.2 U11.1
NetD28_2: D28.2 U12.1
NetD29_2: D29.2 U13.1
NetD30_2: D30.2 U14.1
NetD31_2: D31.2 U15.1
NetD32_2: D32.2 U16.1
NetK1_1: K1.1 P9.1
NetK1_2: K1.2 P9.2
NetK2_1: K2.1 P10.1
NetK2_2: K2.2 P10.2
NetK3_1: K3.1 P11.1
NetK3_2: K3.2 P11.2
NetK4_1: K4.1 P12.1
NetK4_2: K4.2 P12.2
NetK5_1: K5.1 P13.1
NetK5_2: K5.2 P13.2
NetK6_1: K6.1 P14.1
NetK6_2: K6.2 P14.2
NetK7_1: K7.1 P15.1
NetK7_2: K7.2 P15.2
NetK8_1: K8.1 P16.1
NetK8_2: K8.2 P16.2

### Library data of the parts
D1-D8 D17-D24 = 1N5819(SS14): 肖特基二极管
D9-D16 D25-D32 = LED-RED: 红色LED
D33-D40 = 1N4007: 1A整流二极管
K1-K8 = JDQ_307: 继电器
P1-P16 = 2EDG5.08_2: 端子
R1-R72 = Res
U1-U4 U5#2 U6-U16 = TLP521: 光耦

## Nets that join several sheets
VCC+3.3W: Main_Sch (U19.10 U19.11), Power (6 pins)
VCC+5: Main_Sch (R83.2), OneKey_Download (D42.1), Power (6 pins), InputOutput (41 pins)
VREF+: Main_Sch (25 pins), OneKey_Download (Q2.1 R97.2), Power (11 pins)
VREF-: Main_Sch (33 pins), OneKey_Download (9 pins), Power (34 pins), InputOutput (33 pins)
BOOT0: Main_Sch (U18.94), OneKey_Download (R94.1)
BOOT1: Main_Sch (U18.37), OneKey_Download (R95.2)
CPU_IN1: Main_Sch (U18.62), InputOutput (R25.1 U1.4)
CPU_IN2: Main_Sch (U18.63), InputOutput (R26.1 U2.4)
CPU_IN3: Main_Sch (U18.64), InputOutput (R27.1 U3.4)
CPU_IN4: Main_Sch (U18.65), InputOutput (R28.1 U4.4)
CPU_IN5: Main_Sch (U18.66), InputOutput (R29.1 U5#2.4)
CPU_IN6: Main_Sch (U18.78), InputOutput (R30.1 U6.4)
CPU_IN7: Main_Sch (U18.79), InputOutput (R31.1 U7.4)
CPU_IN8: Main_Sch (U18.80), InputOutput (R32.1 U8.4)
CPU_IN9: Main_Sch (U18.81), InputOutput (R57.1 U9.4)
CPU_IN10: Main_Sch (U18.82), InputOutput (R58.1 U10.4)
CPU_IN11: Main_Sch (U18.83), InputOutput (R59.1 U11.4)
CPU_IN12: Main_Sch (U18.84), InputOutput (R60.1 U12.4)
CPU_IN13: Main_Sch (U18.85), InputOutput (R61.1 U13.4)
CPU_IN14: Main_Sch (U18.86), InputOutput (R62.1 U14.4)
CPU_IN15: Main_Sch (U18.87), InputOutput (R63.1 U15.4)
CPU_IN16: Main_Sch (U18.88), InputOutput (R64.1 U16.4)
CPU_JDQ1: Main_Sch (U18.39), InputOutput (R72.1 U17.1)
CPU_JDQ2: Main_Sch (U18.40), InputOutput (R71.1 U17.2)
CPU_JDQ3: Main_Sch (U18.41), InputOutput (R70.1 U17.3)
CPU_JDQ4: Main_Sch (U18.42), InputOutput (R69.1 U17.4)
CPU_JDQ5: Main_Sch (U18.43), InputOutput (R68.1 U17.5)
CPU_JDQ6: Main_Sch (U18.44), InputOutput (R67.1 U17.6)
CPU_JDQ7: Main_Sch (U18.45), InputOutput (R66.1 U17.7)
CPU_JDQ8: Main_Sch (U18.46), InputOutput (R65.1 U17.17)
RESET: Main_Sch (C1.1 JTAG_1.4 R73.1 U18.14), OneKey_Download (D41.1)
USART1_RX: Main_Sch (U18.69), OneKey_Download (U22.2)
USART1_TX: Main_Sch (U18.68), OneKey_Download (U22.3)